# Altium schematic sheet Radio_communication.SchDoc
size A4; PageSetup: Record=PageOptions|CenterHorizontal=True|CenterVertical=True|PrintScale=1.00|XCorrection=1.00|YCorrection=1.00|PrintKind=0|BorderSize=5000000|LeftOffset=0|BottomOffset=0|Orientation=2|PaperLength=1000|PaperWidth=1000|Scale=100|PaperSource=7|PrintQuality=-3|MediaType=1|DitherType=10|PrintScaleMode=1|PaperKind=A4|PaperIndex=9
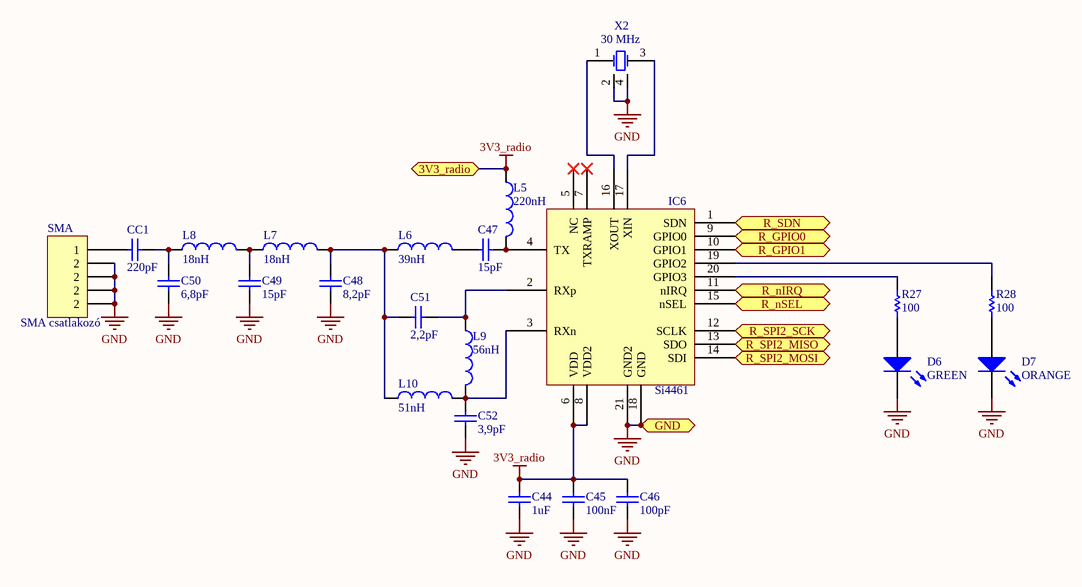
[diagram p0: Radio_communication.SchDoc]

## Parts
C44  value 1uF  [FP_0603_CAP_080]  (hidden comment: Cap)
C45  value 100nF  [FP_0603_CAP_080]  (hidden comment: Cap)
C46  value 100pF  [FP_0603_CAP_080]  (hidden comment: Cap)
C47  value 15pF  [FP_0603_CAP_080]  (hidden comment: Cap)
C48  value 8,2pF  [FP_0603_CAP_080]  (hidden comment: Cap)
C49  value 15pF  [FP_0603_CAP_080]  (hidden comment: Cap)
C50  value 6,8pF  [FP_0603_CAP_080]  (hidden comment: Cap)
C51  value 2,2pF  [FP_0603_CAP_080]  (hidden comment: Cap)
C52  value 3,9pF  [FP_0603_CAP_080]  (hidden comment: Cap)
CC1  value 220pF  [FP_0603_CAP_080]  (hidden comment: Cap)
D6  GREEN  [FP_0805_LED_GREEN]
D7  ORANGE  [FP_0805_LED_GREEN]
IC6  Si4461  [QFN20_thermal_pad]
L5  value 220nH  [FP_0603_CAP_080]  (hidden comment: Inductor)
L6  value 39nH  [FP_0603_CAP_080]  (hidden comment: Inductor)
L7  value 18nH  [FP_0603_CAP_080]  (hidden comment: Inductor)
L8  value 18nH  [FP_0603_CAP_080]  (hidden comment: Inductor)
L9  value 56nH  [FP_0603_CAP_080]  (hidden comment: Inductor)
L10  value 51nH  [FP_0603_CAP_080]  (hidden comment: Inductor)
R27  value 100  [FP_0603_RES]  (hidden comment: Res1)
R28  value 100  [FP_0603_RES]  (hidden comment: Res1)
SMA  SMA csatlakozó  [SMA_connector]
X2  30 MHz  [crystal_sx2520]

## Ports
3V3_radio, GND, R_GPIO0, R_GPIO1, R_nIRQ (out), R_nSEL (in), R_SDN (in), R_SPI2_MISO (out), R_SPI2_MOSI (in), R_SPI2_SCK (in)

## Nets
3V3_radio: C44.2 C45.2 C46.2 IC6.6(VDD) IC6.8(VDD2) L5.1 ; port 3V3_radio
GND: C44.1 C45.1 C46.1 C48.2 C49.2 C50.2 C52.1 D6.2(K) D7.2(K) IC6.18(GND) IC6.21(GND2) SMA.2 X2.2(OSC2) X2.4 ; port GND
R_GPIO0: IC6.9(GPIO0) ; port R_GPIO0
R_GPIO1: IC6.10(GPIO1) ; port R_GPIO1
R_nIRQ: IC6.11(nIRQ) ; port R_nIRQ
R_nSEL: IC6.15(nSEL) ; port R_nSEL
R_SDN: IC6.1(SDN) ; port R_SDN
R_SPI2_MISO: IC6.13(SDO) ; port R_SPI2_MISO
R_SPI2_MOSI: IC6.14(SDI) ; port R_SPI2_MOSI
R_SPI2_SCK: IC6.12(SCLK) ; port R_SPI2_SCK
NetC47_1: C47.1 IC6.4(TX) L5.2
NetC47_2: C47.2 L6.2
NetC48_1: C48.1 C51.1 L6.1 L7.2 L10.1
NetC49_1: C49.1 L7.1 L8.2
NetC50_1: C50.1 CC1.2 L8.1
NetC51_2: C51.2 IC6.2(RXp) L9.1
NetC52_2: C52.2 IC6.3(RXn) L9.2 L10.2
NetCC1_1: CC1.1 SMA.1
NetD6_1: D6.1(A) R27.1
NetD7_1: D7.1(A) R28.1
NetIC6_16: IC6.16(XOUT) X2.1(OSC1)
NetIC6_17: IC6.17(XIN) X2.3
NetIC6_19: IC6.19(GPIO2) R28.2
NetIC6_20: IC6.20(GPIO3) R27.2

Not connected (* = marked no-connect by the designer): IC6 5(NC)* 7(TXRAMP)*

## Library data of the parts
C44-C52 CC1 = Cap: Capacitor; Published: 8-Jun-2000; LatestRevisionDate: 17-Jul-2002; LatestRevisionNote: Re-released for DXP Platform.; PackageReference: RAD-0.3; Publisher: Altium Limited; PackageDescription: Radial Cap, Thru-Hole; 2 Leads; 0.3 in Pin Spacing
D6 D7 = LED: Typical RED GaAs LED; pin to pad: 1>A 2>K
L5-L10 = Inductor: Code_IEC: 1005; Published: 8-Jun-2000; LatestRevisionDate: 29-May-2009; LatestRevisionNote: IPC-7351 Footprint Added.; PackageReference: 0402-A; Publisher: Altium Limited; PackageDescription: Chip Inductor; Code_JEITA: 0402
R27 R28 = Res1: Resistor; Published: 8-Jun-2000; LatestRevisionDate: 17-Jul-2002; LatestRevisionNote: Re-released for DXP Platform.; PackageReference: AXIAL-0.3; Publisher: Altium Limited; PackageDescription: Axial Device, Thru-Hole; 2 Leads; 0.3 in Pin Spacing
SMA = Header 5: Header, 5-Pin; LatestRevisionDate: 17-Jul-2002; LatestRevisionNote: Re-released for DXP Platform.; Publisher: Altium Limited
X2 = XTAL: Crystal Oscillator; Published: 8-Jun-2000; LatestRevisionDate: 17-Jul-2002; LatestRevisionNote: Re-released for DXP Platform.; PackageReference: R38; Publisher: Altium Limited; PackageDescription: Crystal, Thru-Hole; 2 Leads; Body 3.1 x 8.2 mm (Dia.xH)